# Altium schematic sheet QUTMS-TSAL2-S04.SchDoc: Zener Voltage Regulator
size A3; DrawnBy: Joseph Richards; DocumentNumber: 5; Revision: 2; SheetNumber: 2; SheetTotal: 3
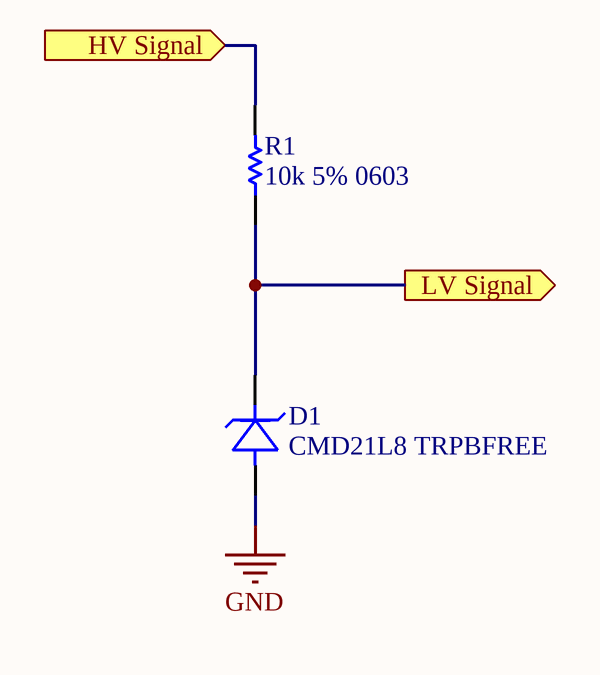
[diagram p0: QUTMS-TSAL2-S04.SchDoc]

## Parts
D1  CMD21L8 TRPBFREE  [SODFL160X80-2N(Zener)]
R1  10k 5% 0603  [Res_ThinFilm_0603 (1,10k)]

## Ports
HV Signal (in), LV Signal (out)

## Nets
GND: D1.A(Anode)
HV Signal: R1.2 ; port HV Signal
LV Signal: D1.K(Cathode) R1.1 ; port LV Signal

## Notes on the sheet
- Revision History:
- Sheet Title:
- Rev
- Date
- Description
- Project:
- Size:
- Drawn By:
- A3
- Number:
- Revision:
- Sheet
- Version:
- of
- QUT Motorsport
- O-120, Gardens Point
- 2 George Street
- Brisbane, QLD 4000
- Australia
- Print Date:
- Print Time:
- File Name:

## Library data of the parts
R1 = 10k 5% 0603: Resistor, SMD, 10k, 0.1W, 5%, 0603